# Altium schematic sheet LightLink.SchDoc
size A4; SheetNumber: 1; SheetTotal: 3
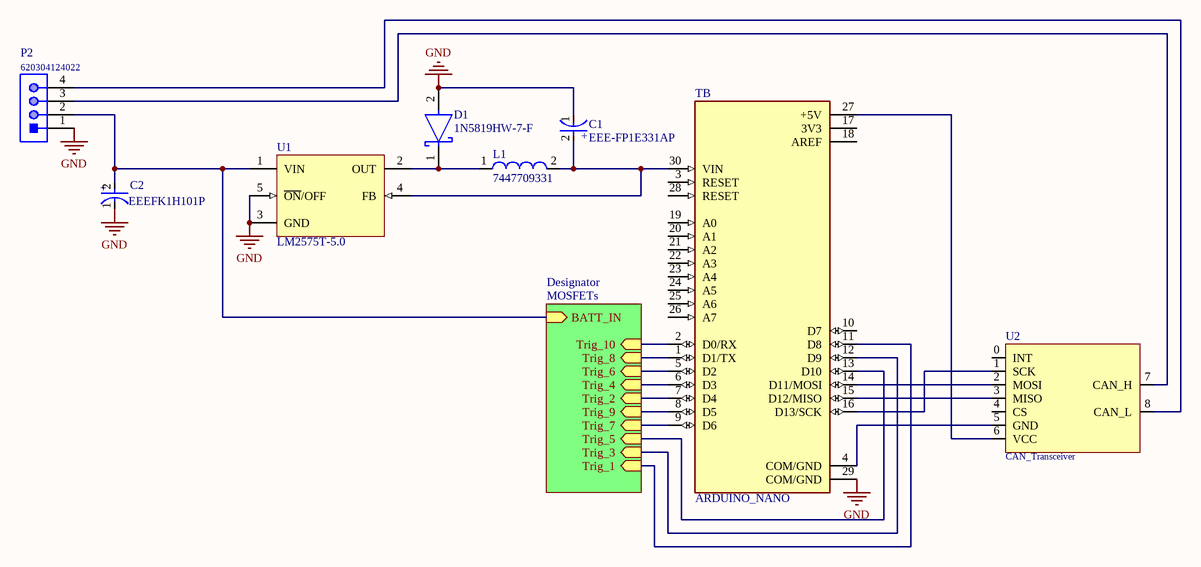
[diagram p0: LightLink.SchDoc]

## Parts
C1  EEE-FP1E331AP  [FP-FPF-MFG]
C2  EEEFK1H101P  [FP-FKF-MFG]
D1  1N5819HW-7-F  [FP-SOD123-IPC_A]
L1  7447709331  [WE-PD-XXL]
P2  620304124022  [620304124022]
TB  ARDUINO_NANO  [SHIELD_ARDUINO_NANO]
U1  LM2575T-5.0  [KC0005A]
U2  CAN_Transceiver

## Sub-sheets
Designator = MOSFETs: Trig_1 (in), Trig_3 (in), Trig_5 (in), Trig_7 (in), Trig_9 (in), Trig_2 (in), Trig_4 (in), Trig_6 (in), Trig_8 (in), Trig_10 (in), BATT_IN (in)

## Nets
GND: C1.1(C) C2.1(C) D1.2(A) P2.1 TB.29(COM/GND) U1.3(GND) U1.5(~{ON}/OFF)
NetC1_2: C1.2(A) L1.2 TB.30(VIN) U1.4(FB)
NetC2_2: C2.2(A) P2.2 U1.1(VIN) ; sheet Designator/BATT_IN
NetD1_1: D1.1(C) L1.1 U1.2(OUT)
NetP2_3: P2.3 U2.7(CAN_H)
NetP2_4: P2.4 U2.8(CAN_L)
NetTB_1: TB.1(D1/TX) ; sheet Designator/Trig_8
NetTB_2: TB.2(D0/RX) ; sheet Designator/Trig_10
NetTB_4: TB.4(COM/GND) U2.5(GND)
NetTB_5: TB.5(D2) ; sheet Designator/Trig_6
NetTB_6: TB.6(D3) ; sheet Designator/Trig_4
NetTB_7: TB.7(D4) ; sheet Designator/Trig_2
NetTB_8: TB.8(D5) ; sheet Designator/Trig_9
NetTB_9: TB.9(D6) ; sheet Designator/Trig_7
NetTB_11: TB.11(D8) ; sheet Designator/Trig_1
NetTB_12: TB.12(D9) ; sheet Designator/Trig_3
NetTB_13: TB.13(D10) ; sheet Designator/Trig_5
NetTB_14: TB.14(D11/MOSI) U2.2(MOSI)
NetTB_15: TB.15(D12/MISO) U2.3(MISO)
NetTB_16: TB.16(D13/SCK) U2.1(SCK)
NetTB_27: TB.27(+5V) U2.6(VCC)

Not connected (* = marked no-connect by the designer): TB 3(RESET) 10(D7) 17(3V3) 18(AREF) 19(A0) 20(A1) 21(A2) 22(A3) 23(A4) 24(A5) 25(A6) 26(A7) 28(RESET); U2 0(INT) 4(CS)

## Notes on the sheet
- (in symbol CMP-2000-06208-3) +
- (in symbol CMP-05427-000082-1) +

## Library data of the parts
C1 = CMP-05427-000082-1: CAP ALUM 330UF 20% 25V SMD; Dielectric Material: Aluminium; Ripple Current (AC): 850mA; Life (Hours): 2000Hour; ESR (Equivalent Series Resistance): 80mR; Leakage Current: 82.5uA; Package Quantity: 500; Height - Seated (Max): 0.402inch; Capacitance: 330uF; Max Operating Temperature: 105°C; Diameter: 8mm; Width: 8.3mm; Packaging: Tape and Reel; Radiation Hardening: No; Lead Pitch: 3.1mm; REACH SVHC: No SVHC; Contact Plating: Tin; Series: FP; Termination: SMD/SMT; RoHS Compliant: Yes; Material: Aluminium; Voltage Rating (DC): 25V; Voltage Rating: 25V; Min Operating Temperature: -55°C; Construction: Cylindrical; Length: 10.5mm; Number of Pins: 2; Case/Package: Radial; Voltage: 25V; Height: 10.2mm; Mount: Surface Mount; Tolerance: 20%; Lead Free: Lead Free; Ripple Current: 850mA
C2 = CMP-2000-06208-3: CAP ALUM 100UF 20% 50V SMD; Leakage Current: 3uA; ESR (Equivalent Series Resistance): 340mR; Material: Aluminium; Ripple Current: 350mA; Life (Hours): 2000Hour; Min Operating Temperature: -55°C; Contact Plating: Tin; REACH SVHC: No SVHC; RoHS Compliant: Yes; Width: 10mm; Radiation Hardening: No; Termination: SMD/SMT; Packaging: Tape and Reel; Max Operating Temperature: 105°C; Case/Package: Radial; Voltage Rating: 50V; Length: 10.2mm; Voltage: 50V; Package Quantity: 1; Voltage Rating (DC): 50V; Height - Seated (Max): 0.402inch; Mount: Surface Mount; Impedance: 340mR; Construction: Cylindrical; Height: 10.2mm; Lead Free: Lead Free; Dielectric Material: Aluminium; Series: FK; Tolerance: 20%; Diameter: 8mm; Ripple Current (AC): 350mA; Capacitance: 100uF; Number of Pins: 2
D1 = CMP-0303-00003-3: DIODE SCHOTTKY 40V 1A SOD123; Forward Voltage: 450mV; Capacitance: 110pF; Max Forward Surge Current (Ifsm): 25A; Peak Reverse Current: 50uA; Polarity: Standard; Element Configuration: Single; Max Power Dissipation: 450mW; Min Operating Temperature: -65°C; Package Quantity: 3000; Contact Plating: Tin; Weight: 0.000353oz; Max Repetitive Reverse Voltage (Vrrm): 40V; Max Reverse Voltage (DC): 40V; Height: 1.25mm; Average Rectified Current: 1A; Width: 1.7mm; Case/Package: SOD-123-2; Lead Free: Lead Free; Max Operating Temperature: 125°C; Current Rating: 1A; Termination: SMD/SMT; Forward Current: 1A; Radiation Hardening: No; Number of Pins: 2; Length: 2.85mm; Voltage Rating (DC): 40V; REACH SVHC: No SVHC; Peak Non-Repetitive Surge Current: 25A; Packaging: Tape and Reel; Output Current: 1A
L1 = CMP-0227-00183-1: SMD-Shielded Power Inductor WE-PD, L = 330 µH; Inductance: 330 ÂµH; PackageReference: WE-PD-XXL; PackageDescription: SMD Inductor, 2-Leads, Body 12.0 x 12.0 mm; ComponentLink1Description: Manufacturer Link; ComponentLink2Description: Datasheet; PackageVersion: 2004; ComponentLink1URL: http://www.we-online.com; DatasheetVersion: ver 1, Oct-2004; ComponentLink2URL: http://www.we-online.de/katalog/media/pdf/7447709331.pdf
P2 = CMP-1502-00662-1: Male Shrouded Header WR-WTB, SMT, Vertical, pitch 2 mm, 1 x 4 position; Manufacturer: Wurth Elektronik; Working Voltage: 100VAC; Contact Resistance: 20mOhm; Pitch: 2mm; Position: 1x4; Part Number: 620304124022; Orientation: Vertical; Publisher: WurthElektronik; Packaging: TapeandReel; Gender: Male; Mounting Technology: SMT; Operating Temperature: -25to85degC; Manufacturer URL: http://www.we-online.de; Package Reference: 620304124022; Datasheet URL: https://katalog.we-online.de/em/datasheet/6203xx124022.pdf
TB = CMP-002-000000-1: ATSAMD21G18A Arduino Nano 33 IoT SAM D ARMÂ® CortexÂ®-M0+ MCU 32-Bit Embedded Evaluation Board; MF: Arduino; Package: None; Value: *; Availability: Unavailable; Pin Count: 30; Design Item ID: ARDUINO_NANO; MP: ARDUINO NANO; Price: None; Component Type: Standard; Source: SnapEDAsch.SchLib; SnapEDA_Link: https://www.snapeda.com/parts/ARDUINO%20NANO/Arduino/view-part/1128261/?ref=snap
U1 = CMP-0069-02026-3: SIMPLE SWITCHER® 1A Step-Down Voltage Regulator, 5-pin TO-220; Manufacturer: Texas Instruments; PackageTopMarking: NSUZXYTTE#*LM2575T*-5.0 P+; PowerWise: N; RoHS: N; Code_JEDEC: TO-220-AB; ComponentLink1Description: Datasheet URL; CompType: Switcher; PackageReference: KC0005A; PinCount: 5; PackageDescription: TO-220, Molded, 5 Lead, Straight; ComponentLink1URL: http://www.ti.com/general/docs/lit/getliterature.tsp?genericPartNumber=LM2575-N&fileType=pdf
U2 = CAN_Transceiver: Footprint for existing SPI transceiver